# Altium project Science Board 2020.PrjPcb
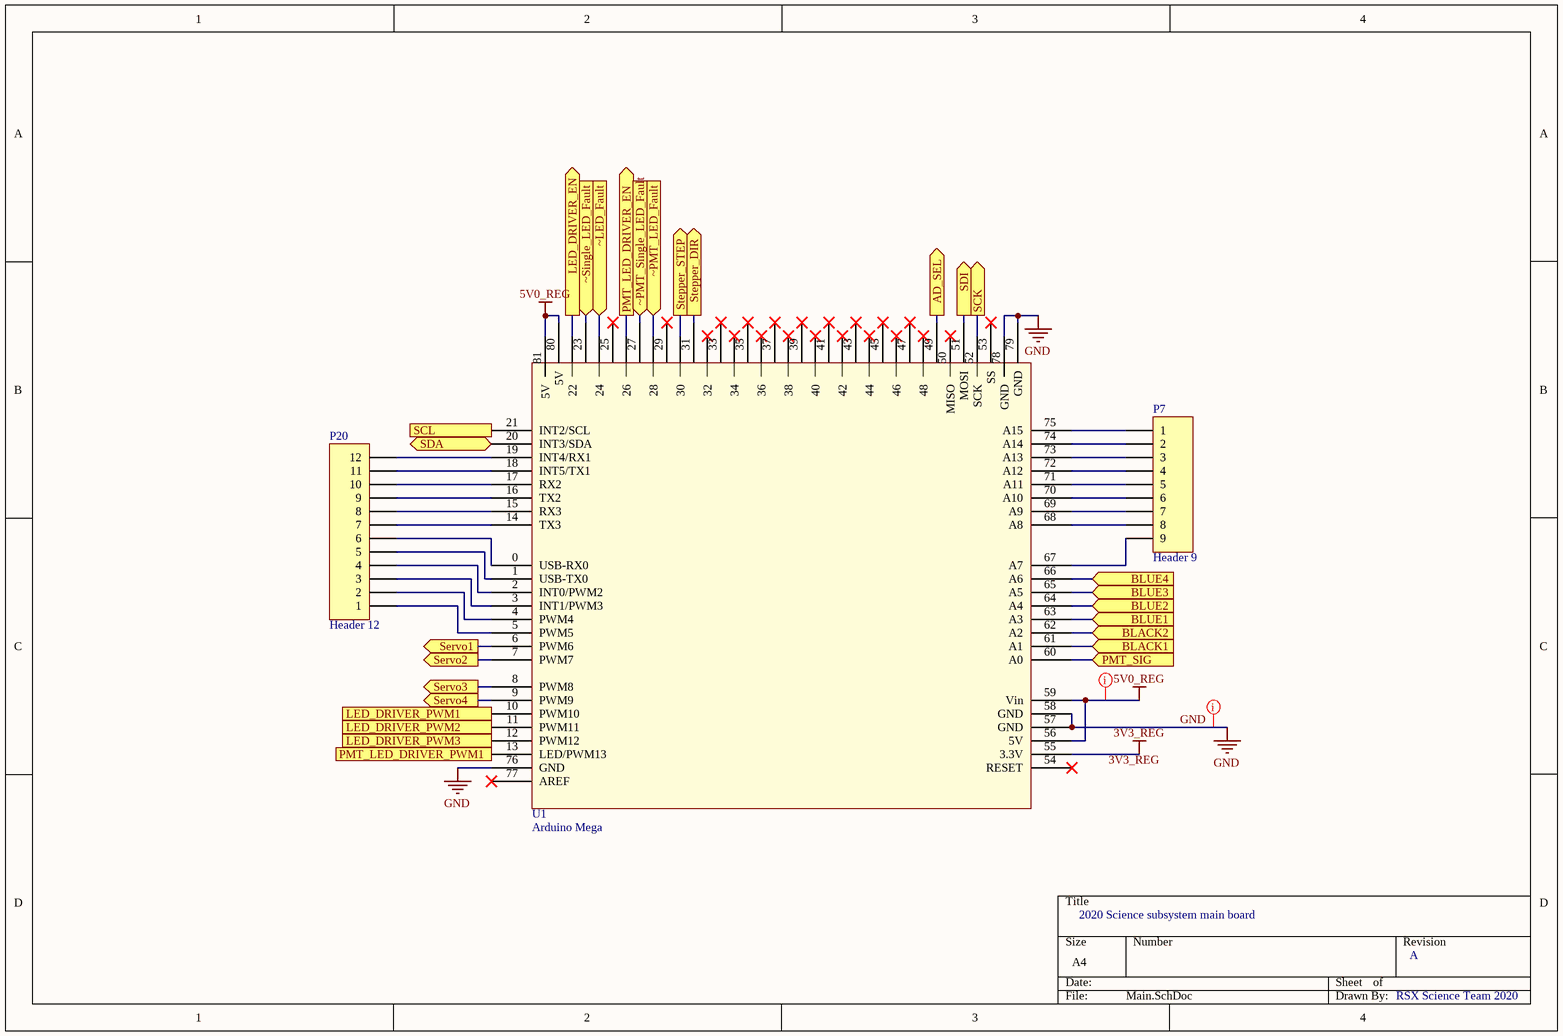
[diagram p0: Main.SchDoc]
4 sheets, 75 parts. Net scope: flat (ports and power ports of the same name join across sheets).
Board file: board.PcbDoc
Sheets:
  Main.SchDoc
  PowerRails.SchDoc
  PowerDevices.SchDoc
  Sensors.SchDoc

## Sheet Main.SchDoc
size A4

### Parts
P7  Header 9  [HDR1X9]
P20  Header 12  [HDR1X12]
U1  Arduino Mega  [Arduino Mega]

### Ports
AD_SEL (out), BLACK1 (in), BLACK2 (in), BLUE1 (in), BLUE2 (in), BLUE3 (in), BLUE4 (in), LED_DRIVER_EN (out), LED_DRIVER_PWM1 (out), LED_DRIVER_PWM2 (out), LED_DRIVER_PWM3 (out), PMT_LED_DRIVER_EN (out), PMT_LED_DRIVER_PWM1 (out), PMT_SIG (in), SCK (out), SCL (out), SDA (bidir), SDI (out), Servo1 (out), Servo2 (out), Servo3 (out), Servo4 (out), Stepper_DIR (out), Stepper_STEP (out), ~LED_Fault (in), ~PMT_LED_Fault (in), ~PMT_Single_LED_Fault (in), ~Single_LED_Fault (in)

### Nets
3V3_REG: U1.55(3.3V)
5V0_REG: U1.56(5V) U1.59(Vin) U1.80(5V) U1.81(5V)
GND: U1.57(GND) U1.58(GND) U1.76(GND) U1.78(GND) U1.79(GND)
NetP2_3: U1.7(PWM7) ; port Servo2
NetP3_3: U1.8(PWM8) ; port Servo3
NetP5_3: U1.9(PWM9) ; port Servo4
NetP6_3: U1.6(PWM6) ; port Servo1
NetP7_1: P7.1 U1.75(A15)
NetP7_2: P7.2 U1.74(A14)
NetP7_3: P7.3 U1.73(A13)
NetP7_4: P7.4 U1.72(A12)
NetP7_5: P7.5 U1.71(A11)
NetP7_6: P7.6 U1.70(A10)
NetP7_7: P7.7 U1.69(A9)
NetP7_8: P7.8 U1.68(A8)
NetP7_9: P7.9 U1.67(A7)
NetP8_1: U1.60(A0) ; port PMT_SIG
NetP9_2: U1.61(A1) ; port BLACK1
NetP10_2: U1.62(A2) ; port BLACK2
NetP11_1: U1.63(A3) ; port BLUE1
NetP12_1: U1.64(A4) ; port BLUE2
NetP13_1: U1.65(A5) ; port BLUE3
NetP14_1: U1.66(A6) ; port BLUE4
NetP16_4: U1.21(INT2/SCL) ; port SCL
NetP16_6: U1.20(INT3/SDA) ; port SDA
NetP20_1: P20.1 U1.5(PWM5)
NetP20_2: P20.2 U1.4(PWM4)
NetP20_3: P20.3 U1.3(INT1/PWM3)
NetP20_4: P20.4 U1.2(INT0/PWM2)
NetP20_5: P20.5 U1.1(USB-TX0)
NetP20_6: P20.6 U1.0(USB-RX0)
NetP20_7: P20.7 U1.14(TX3)
NetP20_8: P20.8 U1.15(RX3)
NetP20_9: P20.9 U1.16(TX2)
NetP20_10: P20.10 U1.17(RX2)
NetP20_11: P20.11 U1.18(INT5/TX1)
NetP20_12: P20.12 U1.19(INT4/RX1)
NetU1_10: U1.10(PWM10) ; port LED_DRIVER_PWM1
NetU1_11: U1.11(PWM11) ; port LED_DRIVER_PWM2
NetU1_12: U1.12(PWM12) ; port LED_DRIVER_PWM3
NetU1_13: U1.13(LED/PWM13) ; port PMT_LED_DRIVER_PWM1
NetU1_22: U1.22 ; port LED_DRIVER_EN
NetU1_23: U1.23 ; port ~Single_LED_Fault
NetU1_24: U1.24 ; port ~LED_Fault
NetU1_26: U1.26 ; port PMT_LED_DRIVER_EN
NetU1_27: U1.27 ; port ~PMT_Single_LED_Fault
NetU1_28: U1.28 ; port ~PMT_LED_Fault
NetU1_30: U1.30 ; port Stepper_STEP
NetU1_31: U1.31 ; port Stepper_DIR
NetU1_49: U1.49 ; port AD_SEL
NetU1_51: U1.51(MOSI) ; port SDI
NetU1_52: U1.52(SCK) ; port SCK

Not connected (* = marked no-connect by the designer): U1 25* 29* 32* 33* 34* 35* 36* 37* 38* 39* 40* 41* 42* 43* 44* 45* 46* 47* 48* 50(MISO)* 53(SS)* 54(RESET)* 77(AREF)*

### Layout directives
rule Width Constraint [Pref Width = 15mil    Min Width = 15mil    Max Width = 15mil]: 5V0_REG, GND

### Notes on the sheet
- 2020 Science subsystem main board
- A
- RSX Science Team 2020
- Labels drawn without touching a wire or pin: 3V3_REG

### Library data of the parts
P7 = Header 9: Header, 9-Pin; LatestRevisionDate: 17-Jul-2002; LatestRevisionNote: Re-released for DXP Platform.; Publisher: Altium Limited
P20 = Header 12: Header, 12-Pin; LatestRevisionDate: 17-Jul-2002; LatestRevisionNote: Re-released for DXP Platform.; Publisher: Altium Limited

## Sheet PowerRails.SchDoc
size A4
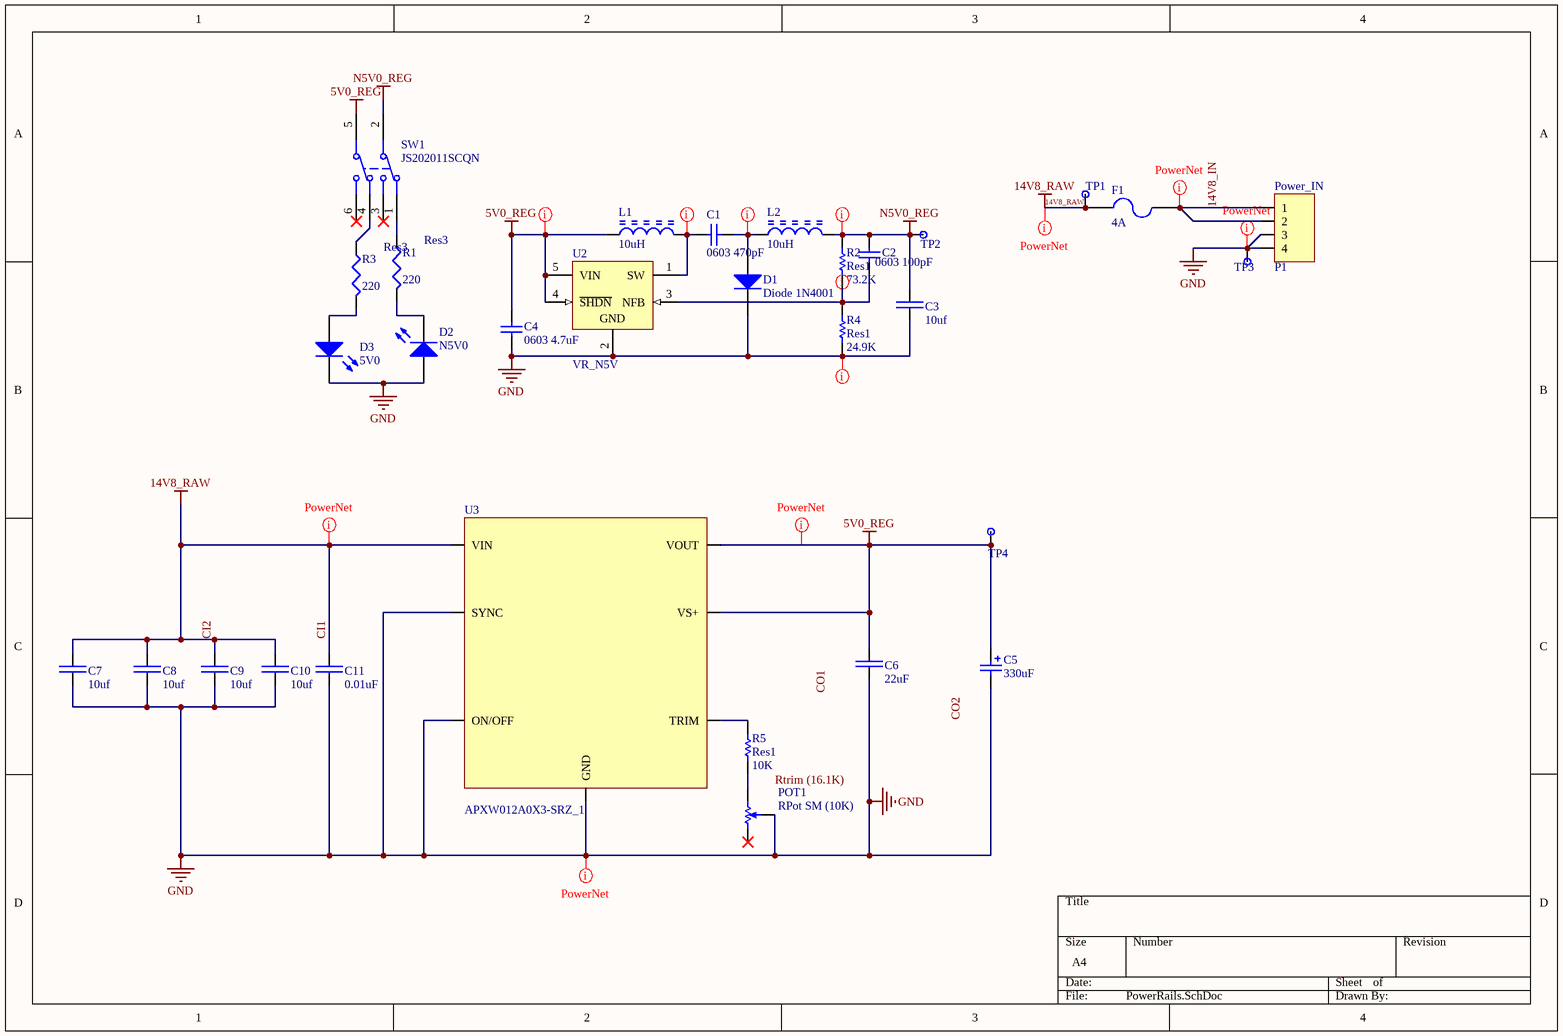
[diagram p1: PowerRails.SchDoc]

### Parts
C1  0603 470pF  [CAPC1608X90X35LL10T15]
C2  0603 100pF  [CAPC1608X90X35LL10T15]
C3  10uf  [10uF capacitor LPB]
C4  0603 4.7uF  [CAPC1608X90X35LL10T15]
C5  330uF  [330uF throught hole]
C6  22uF  [22uF Capacitor]
C7  10uf  [10uF capacitor LPB]
C8  10uf  [10uF capacitor LPB]
C9  10uf  [10uF capacitor LPB]
C10  10uf  [10uF capacitor LPB]
C11  0.01uF  [0.01uF capacitor]
D1  Diode 1N4001  [DO-41]
D2  N5V0  [LTST-C171TBKT]
D3  5V0  [LTST-C171TBKT]
F1  4A  [0157010.DR]
L1  10uH  [BOUR-CM322522_V]
L2  10uH  [BOUR-CM322522_V]
P1  Power_IN  [MOLEX 0039281043]
POT1  RPot SM (10K)  [POT4MM-2]
R1  Res3  value 220  [RESC1608X06N_0603]
R2  Res1  value 73.2K  [RESC1608X06N_0603]
R3  Res3  value 220  [RESC1608X06N_0603]
R4  Res1  value 24.9K  [RESC1608X06N_0603]
R5  Res1  value 10K  [RESC1608X06N_0603]
SW1  JS202011SCQN  [CKCP-JS202011SCQN-6_V]
TP1  5V0_REG  [50_MIL_PAD]  (value not drawn)
TP2  N5V0_REG  [50_MIL_PAD]  (value not drawn)
TP3  12V0_RAW  [50_MIL_PAD]  (value not drawn)
TP4  12V0_RAW  [50_MIL_PAD]  (value not drawn)
U2  VR_N5V  [LT-S5-5-SOT-23_L]
U3  APXW012A0X3-SRZ_1  [APXW012A0X3-SRZ]

### Nets
5V0_REG: C4.2 C5.1 C6.2 L1.1 SW1.5(COM) TP4.1 U2.4(~{SHDN}) U2.5(VIN) U3.3(VS+) U3.5(VOUT)
14V8_RAW: C7.2 C8.2 C9.2 C10.2 C11.2 F1.1 TP1.1 U3.7(VIN)  [also labelled CI1, CI2]
GND: C3.1 C4.1 C5.2 C6.1 C7.1 C8.1 C9.1 C10.1 C11.1 D1.2(K) D2.1(A) D3.2(K) P1.3 P1.4 POT1.W R4.1 TP3.1 U2.2(GND) U3.1(ON/OFF) U3.2(GND) U3.6(SYNC)
N5V0_REG: C2.2 C3.2 L2.2 R2.2 SW1.2(COM) TP2.1
14V8_IN: F1.2 P1.1 P1.2
NetC1_1: C1.1 L1.2 U2.1(SW)
NetC1_2: C1.2 D1.1(A) L2.1
NetC2_1: C2.1 R2.1 R4.2 U2.3(NFB)
NetD2_2: D2.2(K) R1.2
NetD3_1: D3.1(A) R3.2
NetPOT1_CW: POT1.CW(+) R5.1
NetR1_1: R1.1 SW1.1
NetR3_1: R3.1 SW1.4
NetR5_2: R5.2 U3.4(TRIM)

Not connected (* = marked no-connect by the designer): POT1 CCW(-)*; SW1 3* 6*

### Layout directives
net class PowerNet: 5V0_REG, 14V8_IN, 14V8_RAW, GND
rule Width Constraint [Pref Width = 15mil    Min Width = 15mil    Max Width = 15mil]: 5V0_REG, GND, N5V0_REG, NetC1_1, NetC1_2, NetC2_1

### Notes on the sheet
- Labels drawn without touching a wire or pin: CO1, CO2, Rtrim (16.1K)

### Library data of the parts
C1 C2 C4 = CMP-2006-02523-1: Part Number: GRM188R61E475KE11D; Manufacturer: Murata
C3 C7-C10 = GRT31CR61H106ME01L: CAP CER 10UF 50V X5R 1206; Manufacturer 1: Murata; Tolerance: 20%; Supplier 1: Digi-Key; Supplier Part Number 1: 490-12457-1-ND; Manufacturer Part Number 1: GRT31CR61H106ME01L; Stock 1: 8159; Pricing 1: 1=0,50000, 10=0,34900, 100=0,20920, 500=0,15690, 1000=0,13249 (USD); RoHS: Yes; Mount: Surface Mount; Case/Package: 1206; Case Code (Metric): 3216; Case Code (Imperial): 1206; Min Operating Temperature: -55°C; Max Operating Temperature: 85°C; Packaging: Tape and Reel; Capacitance: 10uF; Voltage Rating: 50V; Length: 0.126inch; Width: 0.063inch; Thickness: 0.071inch; Ratings: AEC-Q200; ComponentLink1URL: http://search.murata.co.jp/Ceramy/image/img/A01X/G101/ENG/GRT31CR61H106ME01-01.pdf?src-supplier=Digi-Key; ComponentLink1Description: http://search.murata.co.jp/Ceramy/image/img/A01X/G101/ENG/GRT31CR61H106ME01-01.pdf?src-supplier=Digi-Key; Category: Capacitor
C5 = 35ZLH330MEFCT810X12.5: CAP ALUM 330UF 20% 35V RADIAL; Manufacturer 1: Rubycon; Ripple Current: 731.5mA; Impedance: 39mR; Life (Hours): 10000Hour; Supplier 1: Digi-Key; Supplier Part Number 1: 1189-3752-1-ND; Manufacturer Part Number 1: 35ZLH330MEFCT810X12.5; Stock 1: 14330; Pricing 1: 1=0,52000, 10=0,36900, 100=0,24280 (USD); RoHS: Yes; Mount: Through Hole; Case/Package: Radial; Min Operating Temperature: -40°C; Max Operating Temperature: 105°C; Package Quantity: 1000; Capacitance: 330uF; Packaging: Tape and Reel; Tolerance: 20%; Voltage Rating: 35V; Lead Pitch: 0.197inch; Height - Seated (Max): 0.551inch; ComponentLink1URL: http://www.rubycon.co.jp/en/catalog/e_pdfs/aluminum/e_ZLH.pdf?src-supplier=Digi-Key; ComponentLink1Description: http://www.rubycon.co.jp/en/catalog/e_pdfs/aluminum/e_ZLH.pdf?src-supplier=Digi-Key; ComponentLink2URL: http://www.rubycon.co.jp/en/catalog/e_pdfs/aluminum/Radial_Lead_Alumi_Eng.pdf?src-supplier=Digi-Key; ComponentLink2Description: http://www.rubycon.co.jp/en/catalog/e_pdfs/aluminum/Radial_Lead_Alumi_Eng.pdf?src-supplier=Digi-Key
C6 = GRM32ER71E226KE15L: Cap Ceramic 22uF 25V X7R 10% SMD 1210 125C Embossed T/R; Manufacturer 1: Murata; Supplier 1: Digi-Key; Supplier Part Number 1: 490-5313-6-ND; Manufacturer Part Number 1: GRM32ER71E226KE15L; Stock 1: 52660; Pricing 1: 1=1,78000, 10=1,40600, 100=1,05410, 500=0,79646 (USD); RoHS: Yes; Mount: Surface Mount; Case/Package: 1210; Number of Pins: 2; Case Code (Metric): 3225; Case Code (Imperial): 1210; Material: Ceramic; Min Operating Temperature: -55°C; Max Operating Temperature: 125°C; Capacitance: 22uF; Tolerance: 10%; Dielectric: X7R; Voltage Rating: 25V; Packaging: Tape and Reel; Package Quantity: 1; Voltage Rating (DC): 25V; Termination: SMD/SMT; Voltage: 25V; Length: 3.2mm; Height: 2.5mm; Width: 0.098inch; Thickness: 0.106inch; Depth: 2.5mm; Radiation Hardening: No; REACH SVHC: No SVHC; Lead Free: Lead Free; ComponentLink1URL: https://datasheet.ciiva.com/6072/1697714-6072768.pdf?src-supplier=Farnell; ComponentLink1Description: https://datasheet.ciiva.com/6072/1697714-6072768.pdf?src-supplier=Farnell; ComponentLink2URL: https://datasheet.ciiva.com/16497/product-16497009.pdf?src-supplier=Future+Electronics; ComponentLink2Description: https://datasheet.ciiva.com/16497/product-16497009.pdf?src-supplier=Future+Electronics; ComponentLink3URL: https://datasheet.ciiva.com/3776/2741grm32er71e226ke1523-3776996.pdf?src-supplier=Arrow; ComponentLink3Description: https://datasheet.ciiva.com/3776/2741grm32er71e226ke1523-3776996.pdf?src-supplier=Arrow; ComponentLink4URL: https://datasheet.ciiva.com/11789/0900766b80ef921d-11789129.pdf?src-supplier=RSComponents; ComponentLink4Description: https://datasheet.ciiva.com/11789/0900766b80ef921d-11789129.pdf?src-supplier=RSComponents; ComponentLink5URL: https://datasheet.ciiva.com/29201/451826-da-01-de-vs-kondens-grm32-er71e-226ke15l-29201795.pdf?src-supplier=Conrad; ComponentLink5Description: https://datasheet.ciiva.com/29201/451826-da-01-de-vs-kondens-grm32-er71e-226ke15l-29201795.pdf?src-supplier=Conrad; ComponentLink6URL: https://datasheet.ciiva.com/175/partnumbering-e-01-175746.pdf?src-supplier=Digi-Key; ComponentLink6Description: https://datasheet.ciiva.com/175/partnumbering-e-01-175746.pdf?src-supplier=Digi-Key; ComponentLink7URL: https://datasheet.ciiva.com/175/partnumbering-e-01-175747.pdf?src-supplier=Digi-Key; ComponentLink7Description: https://datasheet.ciiva.com/175/partnumbering-e-01-175747.pdf?src-supplier=Digi-Key; ComponentLink8URL: https://datasheet.ciiva.com/175/partnumbering-e-01-175748.pdf?src-supplier=Digi-Key; ComponentLink8Description: https://datasheet.ciiva.com/175/partnumbering-e-01-175748.pdf?src-supplier=Digi-Key; ComponentLink9URL: https://datasheet.ciiva.com/22703/1697714-22703397.pdf?src-supplier=Element14; ComponentLink9Description: https://datasheet.ciiva.com/22703/1697714-22703397.pdf?src-supplier=Element14; Category: Capacitor
C11 = C0603C103KARACAUTO: Cap Ceramic 0.01uF 250V X7R 10% Pad SMD 0603 125C Automotive T/R; Manufacturer 1: KEMET; Capacitance: 10nF; Supplier 1: Digi-Key; Supplier Part Number 1: 399-17960-1-ND; Manufacturer Part Number 1: C0603C103KARACAUTO; Stock 1: 8483; Pricing 1: 1=0,90000, 10=0,68500, 100=0,49040, 500=0,37964, 1000=0,32691 (USD); RoHS: No; Mount: Surface Mount; Case/Package: 0603; Case Code (Imperial): 0603; Case Code (Metric): 1608; Min Operating Temperature: -55°C; Max Operating Temperature: 125°C; Packaging: Tape and Reel; Tolerance: 10%; Voltage Rating: 250V; Ratings: AEC-Q200; ComponentLink1URL: https://api.kemet.com/component-edge/download/datasheet/C0603C103KARACAUTO.pdf?src-supplier=Digi-Key; ComponentLink1Description: https://api.kemet.com/component-edge/download/datasheet/C0603C103KARACAUTO.pdf?src-supplier=Digi-Key; Category: Capacitor
D1 = Diode 1N4001: 1 Amp General Purpose Rectifier; Published: 8-Jun-2000; LatestRevisionDate: 17-Jul-2002; LatestRevisionNote: Re-released for DXP Platform.; DatasheetVersion: 1998; PackageVersion: Aug-1999; PackageReference: DO-41; Publisher: Altium Limited; PackageDescription: Diode, Axial; Body 5.2 x 2.7 mm (LxDia. max), Lead Dia. 0.86 mm (max); Code_JEDEC: DO-204-AL; ComponentLink1Description: Manufacturer Link; ComponentLink1URL: http://www.fairchildsemi.com/; ComponentLink2Description: Datasheet; ComponentLink2URL: http://www.fairchildsemi.com/ds/1N%2F1N4001.pdf
D2 D3 = Blue LED
F1 = Fuse 2: Fuse; Published: 8-Jun-2000; LatestRevisionDate: 17-Jul-2002; LatestRevisionNote: Re-released for DXP Platform.; PackageReference: PIN-W2/E2.8; Publisher: Altium Limited; PackageDescription: Thru-Hole; 2 Leads
L1 L2 = CMP-1747-00008-1: Chip Inductor / , 10 uH, +/- 10%, -40 to 125 degC, 1210 (3225 Metric), RoHS, Tape and Reel; Current Rating: 1.5 A; Colour: White; Gender: Female; Connector Type: USB; Min Operating Temperature: -55 degC; ComponentLink2Description: Datasheet; Packaging: Tray; Contact Material: Bronze; ComponentLink1Description: Manufacturer URL; PackageDescription: 2-Pin Surface Mount Device, Body 3.2 x 2.5 mm; Contact Plating: Gold; Max Operating Temperature: 85 degC; ComponentLink2URL: http://www.bourns.com/docs/Product-Datasheets/cm322522.pdf; PackageReference: 1210; Radiation Hardening: No; DatasheetVersion: Aug-14; Package Quantity: 100; Pins: 4; Mount: Through Hole; Lead Pitch: 2.5 mm; ComponentLink1URL: http://www.bourns.com/; Height: 15.9 mm; RoHSCompliant: true; Width: 11.15 mm
P1 = Molex 0039281043: Mini-Fit Jr. Header, Dual Row, Right-Angle, with Snap-in Plastic Peg PCB Lock, 6 Circuits, PA Polyamide Nylon 6/6 94V-2, 0.76µm Select Gold (Au) Plating
POT1 = RPot SM: Square Trimming Potentiometer; Published: 17-Dec-2003; DatasheetVersion: Oct-2003; PackageReference: POT4MM-2; Publisher: Altium Limited; PackageDescription: Square Trimming Potentiometer; ComponentLink1Description: Manufacturer Link; ComponentLink1URL: http://bourns.com/2/search.html
R1 R3 = Res3: Resistor; Published: 8-Jun-2000; LatestRevisionDate: 29-May-2009; LatestRevisionNote: IPC-7351 Footprint Added.; PackageReference: J1-0603; Publisher: Altium Limited; PackageDescription: Chip Resistor
R2 R4 R5 = Res1: Resistor; Published: 8-Jun-2000; LatestRevisionDate: 17-Jul-2002; LatestRevisionNote: Re-released for DXP Platform.; PackageReference: AXIAL-0.3; Publisher: Altium Limited; PackageDescription: Axial Device, Thru-Hole; 2 Leads; 0.3 in Pin Spacing
SW1 = CMP-2000-05087-1: Switch Slide DPDT, 0.3 A, 6 V, -40 to 85 degC, 6-Pin SMD, RoHS, Tape and Reel; Manufacturer: C&K Components; Contact Rating @ Voltage: 0.3@6VDCA; COO: US; Maximum DC Voltage Rating: 6V; Minimum Insulation Resistance: 100MOhm; Actuator Color: Black; Body Orientation: Straight; Actuator Material: Nylon4/6; Dielectric Strength: 500VAC; Maximum Contact Resistance: 70mOhm; Actuator Style: TopSlide; Electrical Life: 15000Cycles; Seal Location: N/A; Base Material: N/A; Mechanical Life: N/A; Switch Configuration: N/A; HTS: 8536509050; Contact Material: CopperAlloy; Supplier Standard Pack: 5,000; Manufacturer URL: http://www.ckswitches.com; Supplier: C&KComponents; Datasheet URL: http://datasheet.octopart.com/JS202011SCQN-C%26K-Components-datasheet-62100994.pdf; Housing Material: Nylon4/6; Product Weight: N/A; Dimension: 9x7.5x5.5mm; Maximum AC Voltage Rating: N/A; ECCN: EAR99; Contact Plating: Silver; Pole Throw Configuration: DPDT; Packaging: TapeandReel; Part No: JS202011SCQN; Datasheet Version: Sep-15; Seal Description: N/A; RoHS: Yes; Mounting: SurfaceMount,GullWing; Family: JS; Type: Sub-Miniature; Operating Temperature: -40to85C
TP1-TP4 = TestPt
U2 = CMP-0491-01503-1: Micropower Inverting DC/DC Converter, 5-pin SOT23 (S5-5), -40 to 85 degC, Pb-Free, Mini Tape and Reel; PartNumber: LT1617ES5#TRMPBF; Manufacturer: Linear Technology; Number of Outputs: 1; RoHS: TRUE; ComponentLink3URL: http://cds.linear.com/docs/en/datasheet/17278fb.pdf; ComponentLink2Description: Datasheet; Packing: Mini Tape and Reel; PackageReference: S5-5; ComponentLink1URL: http://www.linear.com/; Mounting Technology: Surface Mount; PackageDescription: 5-Pin Plastic SOT-23, Body 1.625 x 2.90 mm, Pitch 0.95 mm; ComponentLink3Description: Package Specification; ComponentLink2URL: http://cds.linear.com/docs/en/datasheet/16171f.pdf; PackageVersion: Aug-07; ComponentLink1Description: Manufacturer URL
U3 = APXW012A0X3-SRZ_1: DC DC CONVERTER 3-18V 12A; Manufacturer 1: GE; Number of Outputs: 1; Min Input Voltage: 9V; Max Input Voltage: 36V; Voltage - Output 1: 18V; Efficiency: 95.5%; Supplier 1: Avnet; Supplier Part Number 1: 150028492; Manufacturer Part Number 1: APXW012A0X3-SRZ; Stock 1: 0; RoHS: Yes; Mount: Surface Mount; Case/Package: Module; Number of Pins: 9; Min Operating Temperature: -40°C; Max Operating Temperature: 85°C; Packaging: Tape and Reel; Max Output Current: 12A; Current - Output 1: 12A; Package Quantity: 140; Output Current: 12A; Output Voltage: 18V; Features: OCP,OTP; Length: 1.3inch; Height: 0.39inch; Width: 0.53inch; ComponentLink1URL: http://apps.geindustrial.com/publibrary/checkout/DS-APXW012?TNR=Data%20Sheets&src-supplier=Avnet; ComponentLink1Description: http://apps.geindustrial.com/publibrary/checkout/DS-APXW012?TNR=Data%20Sheets&src-supplier=Avnet; ComponentLink2URL: http://apps.geindustrial.com/publibrary/checkout/DS-APXW012?TNR=Data%20Sheets|DS-APXW012|generic&src-supplier=Digi-Key; ComponentLink2Description: http://apps.geindustrial.com/publibrary/checkout/DS-APXW012?TNR=Data%20Sheets|DS-APXW012|generic&src-supplier=Digi-Key; ComponentLink3URL: http://apps.geindustrial.com/publibrary/checkout/DS-APXW012?TNR=Data%20Sheets%7CDS-APXW012%7Cgeneric&src-supplier=Mouser; ComponentLink3Description: http://apps.geindustrial.com/publibrary/checkout/DS-APXW012?TNR=Data%20Sheets%7CDS-APXW012%7Cgeneric&src-supplier=Mouser; Category: Buck Converter

## Sheet PowerDevices.SchDoc
size A4
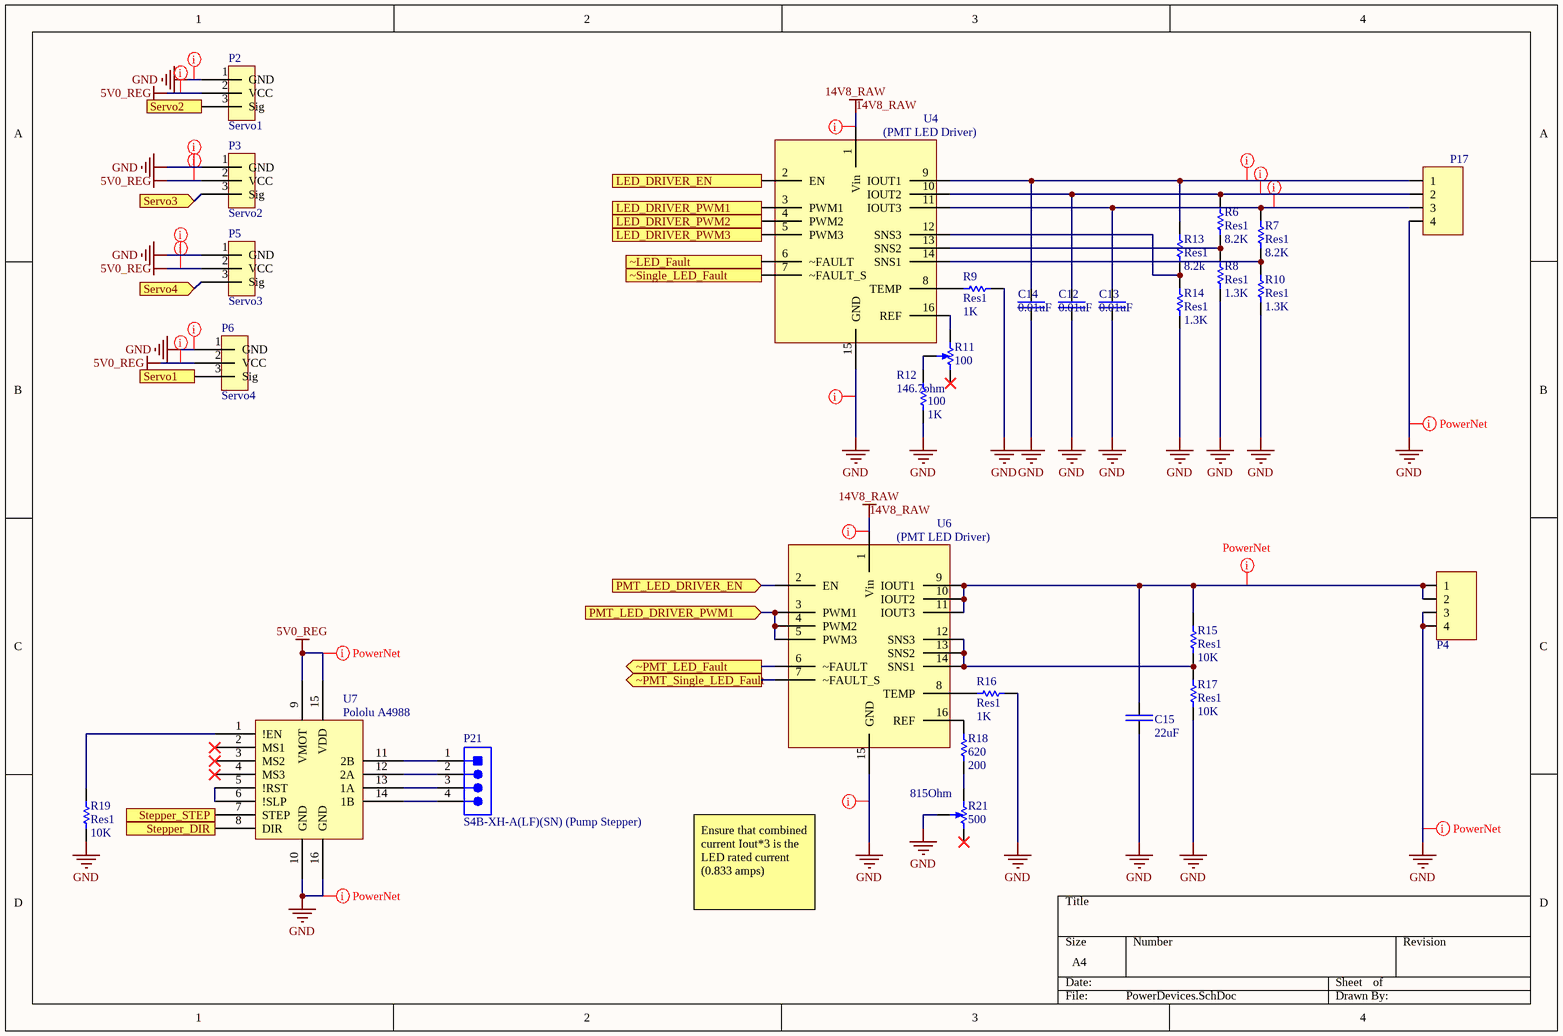
[diagram p2: PowerDevices.SchDoc]

### Parts
C12  0.01uF  [0.01uF capacitor]
C13  0.01uF  [0.01uF capacitor]
C14  0.01uF  [0.01uF capacitor]
C15  22uF  [22uF Capacitor]
P2  Servo1  [Header3]
P3  Servo2  [Header3]
P4  Mini-Fit Jr 4 Pos  [MOLEX 0039281043]  (value not drawn)
P5  Servo3  [Header3]
P6  Servo4  [Header3]
P17  Mini-Fit Jr 4 Pos  [MOLEX 0039281043]  (value not drawn)
P21  S4B-XH-A(LF)(SN) (Pump Stepper)  [JST-S4B-XH-A(LF)(SN)_V]
R6  Res1  value 8.2K  [RESC1608X06N_0603]
R7  Res1  value 8.2K  [RESC1608X06N_0603]
R8  Res1  value 1.3K  [RESC1608X06N_0603]
R9  Res1  value 1K  [RESC1608X06N_0603]
R10  Res1  value 1.3K  [RESC1608X06N_0603]
R11  100  [POT-LV10]
R12  100  value 1K  [RESC1608X06N_0603]
R13  Res1  value 8.2k  [RESC1608X06N_0603]
R14  Res1  value 1.3K  [RESC1608X06N_0603]
R15  Res1  value 10K  [RESC1608X06N_0603]
R16  Res1  value 1K  [RESC1608X06N_0603]
R17  Res1  value 10K  [RESC1608X06N_0603]
R18  620  value 200  [RESC1608X06N_0603]
R19  Res1  value 10K  [RESC1608X06N_0603]
R21  500  [POT-LV10]
U4  (PMT LED Driver)  [HTSSOP16]
U6  (PMT LED Driver)  [HTSSOP16]
U7  Pololu A4988  [Stepper Driver Pololu A4988]

### Ports
LED_DRIVER_EN (in), LED_DRIVER_PWM1 (in), LED_DRIVER_PWM2 (in), LED_DRIVER_PWM3 (in), PMT_LED_DRIVER_EN (in), PMT_LED_DRIVER_PWM1 (in), Servo1 (in), Servo2 (in), Servo3 (in), Servo4 (in), Stepper_DIR (in), Stepper_STEP (in), ~LED_Fault (out), ~PMT_LED_Fault (out), ~PMT_Single_LED_Fault (out), ~Single_LED_Fault (out)

### Nets
5V0_REG: P2.2(VCC) P3.2(VCC) P5.2(VCC) P6.2(VCC) U7.9(VMOT) U7.15(VDD)
14V8_RAW: U4.1(Vin) U6.1(Vin)
GND: C12.1 C13.1 C14.1 C15.1 P2.1(GND) P3.1(GND) P4.3 P4.4 P5.1(GND) P6.1(GND) P17.4 R8.1 R9.2 R10.1 R12.2 R14.1 R16.2 R17.1 R19.1 R21.W U4.15(GND) U6.15(GND) U7.10(GND) U7.16(GND)
NetC12_2: C12.2 P17.2 R6.2 U4.10(IOUT2)
NetC13_2: C13.2 P17.3 R7.2 U4.11(IOUT3)
NetC14_2: C14.2 P17.1 R13.1 U4.9(IOUT1)
NetC15_2: C15.2 P4.1 P4.2 R15.1 U6.9(IOUT1) U6.10(IOUT2) U6.11(IOUT3)
NetP2_3: P2.3(Sig) ; port Servo2
NetP3_3: P3.3(Sig) ; port Servo3
NetP5_3: P5.3(Sig) ; port Servo4
NetP6_3: P6.3(Sig) ; port Servo1
NetP21_1: P21.1 U7.11(2B)
NetP21_2: P21.2 U7.12(2A)
NetP21_3: P21.3 U7.13(1A)
NetP21_4: P21.4 U7.14(1B)
NetR6_1: R6.1 R8.2 U4.13(SNS2)
NetR7_1: R7.1 R10.2 U4.14(SNS1)
NetR9_1: R9.1 U4.8(TEMP)
NetR11_CCW: R11.CCW(-) U4.16(REF)
NetR11_W: R11.W R12.1
NetR13_2: R13.2 R14.2 U4.12(SNS3)
NetR15_2: R15.2 R17.2 U6.12(SNS3) U6.13(SNS2) U6.14(SNS1)
NetR16_1: R16.1 U6.8(TEMP)
NetR18_1: R18.1 R21.CCW(-)
NetR18_2: R18.2 U6.16(REF)
NetR19_2: R19.2 U7.1(!EN)
NetU1_10: U4.3(PWM1) ; port LED_DRIVER_PWM1
NetU1_11: U4.4(PWM2) ; port LED_DRIVER_PWM2
NetU1_12: U4.5(PWM3) ; port LED_DRIVER_PWM3
NetU1_13: U6.3(PWM1) U6.4(PWM2) U6.5(PWM3) ; port PMT_LED_DRIVER_PWM1
NetU1_22: U4.2(EN) ; port LED_DRIVER_EN
NetU1_23: U4.7(~FAULT_S) ; port ~Single_LED_Fault
NetU1_24: U4.6(~FAULT) ; port ~LED_Fault
NetU1_26: U6.2(EN) ; port PMT_LED_DRIVER_EN
NetU1_27: U6.7(~FAULT_S) ; port ~PMT_Single_LED_Fault
NetU1_28: U6.6(~FAULT) ; port ~PMT_LED_Fault
NetU1_30: U7.7(STEP) ; port Stepper_STEP
NetU1_31: U7.8(DIR) ; port Stepper_DIR
NetU7_5: U7.5(!RST) U7.6(!SLP)

Not connected (* = marked no-connect by the designer): R11 CW(+)*; R21 CW(+)*; U7 2(MS1)* 3(MS2)* 4(MS3)*

### Layout directives
rule Width Constraint [Pref Width = 15mil    Min Width = 15mil    Max Width = 15mil]: 5V0_REG, 14V8_RAW, GND, NetC12_2, NetC13_2, NetC14_2
net class PowerNet: GND, NetC15_2
mark named PowerNet: 5V0_REG, GND

### Notes on the sheet
- (near R12) 146.7ohm
- (near R21) 815Ohm
- Ensure that combined current Iout*3 is the LED rated current (0.833 amps)

### Library data of the parts
C12-C14 = C0603C103KARACAUTO: as C11 on sheet PowerRails; Supplier 1: Digi-Key; Supplier Part Number 1: 399-17960-1-ND; Manufacturer Part Number 1: C0603C103KARACAUTO; Stock 1: 8483; Pricing 1: 1=0,90000, 10=0,68500, 100=0,49040, 500=0,37964, 1000=0,32691 (USD); RoHS: No; Mount: Surface Mount; Case/Package: 0603; Case Code (Imperial): 0603; Case Code (Metric): 1608; Min Operating Temperature: -55°C; Max Operating Temperature: 125°C; Packaging: Tape and Reel; Tolerance: 10%; Voltage Rating: 250V; Ratings: AEC-Q200; ComponentLink1URL: https://api.kemet.com/component-edge/download/datasheet/C0603C103KARACAUTO.pdf?src-supplier=Digi-Key; ComponentLink1Description: https://api.kemet.com/component-edge/download/datasheet/C0603C103KARACAUTO.pdf?src-supplier=Digi-Key; Category: Capacitor
C15 = GRM32ER71E226KE15L: as C6 on sheet PowerRails; Supplier 1: Digi-Key; Supplier Part Number 1: 490-5313-6-ND; Manufacturer Part Number 1: GRM32ER71E226KE15L; Stock 1: 52660; Pricing 1: 1=1,78000, 10=1,40600, 100=1,05410, 500=0,79646 (USD); RoHS: Yes; Mount: Surface Mount; Case/Package: 1210; Number of Pins: 2; Case Code (Metric): 3225; Case Code (Imperial): 1210; Material: Ceramic; Min Operating Temperature: -55°C; Max Operating Temperature: 125°C; Capacitance: 22uF; Tolerance: 10%; Dielectric: X7R; Voltage Rating: 25V; Packaging: Tape and Reel; Package Quantity: 1; Voltage Rating (DC): 25V; Termination: SMD/SMT; Voltage: 25V; Length: 3.2mm; Height: 2.5mm; Width: 0.098inch; Thickness: 0.106inch; Depth: 2.5mm; Radiation Hardening: No; REACH SVHC: No SVHC; Lead Free: Lead Free; ComponentLink1URL: https://datasheet.ciiva.com/6072/1697714-6072768.pdf?src-supplier=Farnell; ComponentLink1Description: https://datasheet.ciiva.com/6072/1697714-6072768.pdf?src-supplier=Farnell; ComponentLink2URL: https://datasheet.ciiva.com/16497/product-16497009.pdf?src-supplier=Future+Electronics; ComponentLink2Description: https://datasheet.ciiva.com/16497/product-16497009.pdf?src-supplier=Future+Electronics; ComponentLink3URL: https://datasheet.ciiva.com/3776/2741grm32er71e226ke1523-3776996.pdf?src-supplier=Arrow; ComponentLink3Description: https://datasheet.ciiva.com/3776/2741grm32er71e226ke1523-3776996.pdf?src-supplier=Arrow; ComponentLink4URL: https://datasheet.ciiva.com/11789/0900766b80ef921d-11789129.pdf?src-supplier=RSComponents; ComponentLink4Description: https://datasheet.ciiva.com/11789/0900766b80ef921d-11789129.pdf?src-supplier=RSComponents; ComponentLink5URL: https://datasheet.ciiva.com/29201/451826-da-01-de-vs-kondens-grm32-er71e-226ke15l-29201795.pdf?src-supplier=Conrad; ComponentLink5Description: https://datasheet.ciiva.com/29201/451826-da-01-de-vs-kondens-grm32-er71e-226ke15l-29201795.pdf?src-supplier=Conrad; ComponentLink6URL: https://datasheet.ciiva.com/175/partnumbering-e-01-175746.pdf?src-supplier=Digi-Key; ComponentLink6Description: https://datasheet.ciiva.com/175/partnumbering-e-01-175746.pdf?src-supplier=Digi-Key; ComponentLink7URL: https://datasheet.ciiva.com/175/partnumbering-e-01-175747.pdf?src-supplier=Digi-Key; ComponentLink7Description: https://datasheet.ciiva.com/175/partnumbering-e-01-175747.pdf?src-supplier=Digi-Key; ComponentLink8URL: https://datasheet.ciiva.com/175/partnumbering-e-01-175748.pdf?src-supplier=Digi-Key; ComponentLink8Description: https://datasheet.ciiva.com/175/partnumbering-e-01-175748.pdf?src-supplier=Digi-Key; ComponentLink9URL: https://datasheet.ciiva.com/22703/1697714-22703397.pdf?src-supplier=Element14; ComponentLink9Description: https://datasheet.ciiva.com/22703/1697714-22703397.pdf?src-supplier=Element14; Category: Capacitor
P2 P3 P5 P6 = Header3
P4 P17 = Molex 0039281043: as P1 on sheet PowerRails
P21 = CMP-1755-00007-1: Male Header, Pitch 2.5 mm, 1 x 4 Position, Height 6.1 mm, Tail Length 3.4 mm, -25 to 85 degC, RoHS, Bulk; PackageReference: S4B-XH-A(LF)(SN); ComponentLink1Description: Manufacturer URL; DatasheetVersion: May-16; ComponentLink2Description: Datasheet; ComponentLink2URL: http://www.jst-mfg.com/product/pdf/eng/eXH.pdf; ComponentLink1URL: http://www.jst.com/home2.html; PackageDescription: Male Header, Pitch 2.5 mm, 1 x 4 Position, Height 6.1 mm, Tail Length 3.4 mm
R6-R10 R12-R19 = Res1: Resistor; Published: 8-Jun-2000; LatestRevisionDate: 17-Jul-2002; LatestRevisionNote: Re-released for DXP Platform.; PackageReference: AXIAL-0.3; Publisher: Altium Limited; PackageDescription: Axial Device, Thru-Hole; 2 Leads; 0.3 in Pin Spacing
R11 R21 = RPot SM: Square Trimming Potentiometer (100 ohm); Published: 17-Dec-2003; DatasheetVersion: Oct-2003; PackageReference: POT4MM-2; Publisher: Altium Limited; PackageDescription: Square Trimming Potentiometer; ComponentLink1Description: Manufacturer Link; ComponentLink1URL: http://bourns.com/2/search.html
U4 U6 = TPS92630QPWPRQ1
U7 = stepper driver Pololu a4988

## Sheet Sensors.SchDoc
size A4
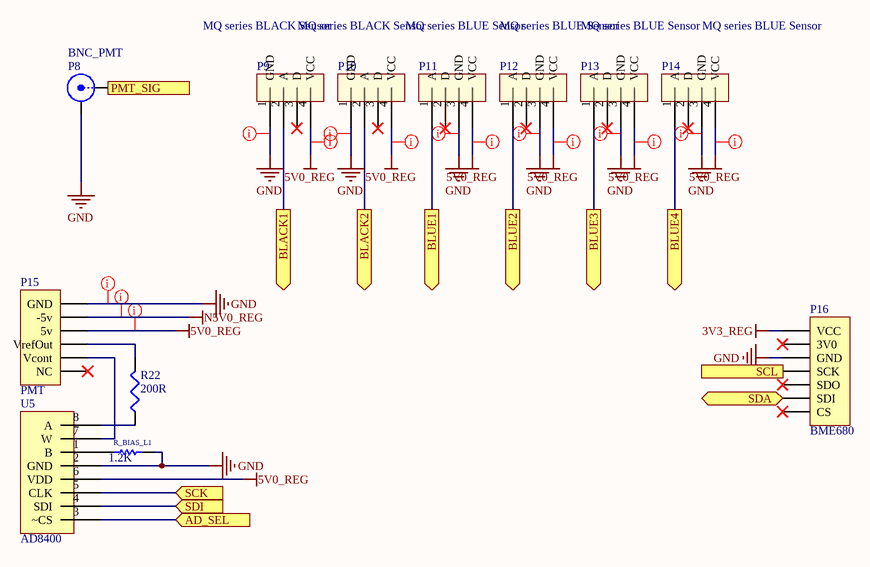
[diagram p3: Sensors.SchDoc]

### Parts
P8  BNC_PMT  [BNC_RA CON]
P9  MQ series BLACK Sensor  [MQ series BLACK sensor]
P10  MQ series BLACK Sensor  [MQ series BLACK sensor]
P11  MQ series BLUE Sensor  [MQ series BLUE sensor]
P12  MQ series BLUE Sensor  [MQ series BLUE sensor]
P13  MQ series BLUE Sensor  [MQ series BLUE sensor]
P14  MQ series BLUE Sensor  [MQ series BLUE sensor]
P15  PMT  [HDR1X6H]
P16  BME680  [HDR1X7]
R22  200R  [RESC1608X06N_0603]
R_BIAS_L1  1.2K  [RESC1608X06N_0603]
U5  AD8400  [AD8400(SOIC8)]

### Ports
AD_SEL (in), BLACK1 (out), BLACK2 (out), BLUE1 (out), BLUE2 (out), BLUE3 (out), BLUE4 (out), PMT_SIG (out), SCK (in), SCL (in), SDA (bidir), SDI (in)

### Nets
3V3_REG: P16.1(VCC)
5V0_REG: P9.4(VCC) P10.4(VCC) P11.4(VCC) P12.4(VCC) P13.4(VCC) P14.4(VCC) P15.6(5v) U5.6(VDD)
GND: P8.2(Y) P9.1(GND) P10.1(GND) P11.3(GND) P12.3(GND) P13.3(GND) P14.3(GND) P15.4(GND) P16.3(GND) R_BIAS_L1.2 U5.2(GND)
N5V0_REG: P15.5(-5v)
NetP8_1: P8.1(X) ; port PMT_SIG
NetP9_2: P9.2(A) ; port BLACK1
NetP10_2: P10.2(A) ; port BLACK2
NetP11_1: P11.1(A) ; port BLUE1
NetP12_1: P12.1(A) ; port BLUE2
NetP13_1: P13.1(A) ; port BLUE3
NetP14_1: P14.1(A) ; port BLUE4
NetP15_2: P15.2(Vcont) U5.7(W)
NetP15_3: P15.3(VrefOut) R22.2
NetP16_4: P16.4(SCK) ; port SCL
NetP16_6: P16.6(SDI) ; port SDA
NetR22_1: R22.1 U5.8(A)
NetR_BIAS_L1_1: R_BIAS_L1.1 U5.1(B)
NetU1_49: U5.3(~CS) ; port AD_SEL
NetU1_51: U5.4(SDI) ; port SDI
NetU1_52: U5.5(CLK) ; port SCK

Not connected (* = marked no-connect by the designer): P9 3(D)*; P10 3(D)*; P11 2(D)*; P12 2(D)*; P13 2(D)*; P14 2(D)*; P15 1(NC)*; P16 2(3V0)* 5(SDO)* 7(CS)*

### Layout directives
rule Width Constraint [Pref Width = 15mil    Min Width = 15mil    Max Width = 15mil]: 5V0_REG, GND, N5V0_REG

### Library data of the parts
P8 = BNC: BNC Elbow Connector; LatestRevisionDate: 17-Jul-2002; LatestRevisionNote: Re-released for DXP Platform.; Publisher: Altium Limited
P15 = Header 6H: Header, 6-Pin, Right Angle; LatestRevisionDate: 17-Jul-2002; LatestRevisionNote: Re-released for DXP Platform.; Publisher: Altium Limited
P16 = Header 7: Header, 7-Pin; LatestRevisionDate: 17-Jul-2002; LatestRevisionNote: Re-released for DXP Platform.; Publisher: Altium Limited
R22 = RC1206FR-07200RL: RES SMD 200 OHM 1% 1/4W 1206; Manufacturer 1: Yageo; Temperature Coefficient: 100ppm/°C; Voltage Rating (DC): 200V; Power Rating: 250mW; Supplier 1: Digi-Key; Supplier Part Number 1: 311-200FRCT-ND; Manufacturer Part Number 1: RC1206FR-07200RL; Stock 1: 3032350; Pricing 1: 1=0,10000, 10=0,07100, 100=0,02910, 1000=0,01306, 2500=0,01134 (USD); RoHS: Yes; Mount: Surface Mount; Case/Package: 1206; Weight: 0.000571oz; Case Code (Imperial): 1206; Case Code (Metric): 3216; Min Operating Temperature: -55°C; Max Operating Temperature: 155°C; Tolerance: 1%; Resistance: 200R; Packaging: Tape and Reel; Composition: Thick Film; Voltage Rating: 200V; Termination: SMD/SMT; Military Standard: Not; Length: 3.1mm; Height: 0.55mm; Width: 1.6mm; Depth: 1.6mm; Lead Free: Lead Free; ComponentLink1URL: https://datasheet.ciiva.com/11808/0900766b80c6630a-11808603.pdf?src-supplier=RSComponents; ComponentLink1Description: https://datasheet.ciiva.com/11808/0900766b80c6630a-11808603.pdf?src-supplier=RSComponents; Category: Resistor
R_BIAS_L1 = Res1: Resistor; Published: 8-Jun-2000; LatestRevisionDate: 17-Jul-2002; LatestRevisionNote: Re-released for DXP Platform.; PackageReference: AXIAL-0.3; Publisher: Altium Limited; PackageDescription: Axial Device, Thru-Hole; 2 Leads; 0.3 in Pin Spacing
U5 = Component_1

## Nets that join several sheets
3V3_REG: Main (U1.55), Sensors (P16.1)
5V0_REG: Main (U1.56 U1.59 U1.80 U1.81), PowerRails (10 pins), PowerDevices (6 pins), Sensors (8 pins)
14V8_RAW: PowerRails (8 pins), PowerDevices (U4.1 U6.1)
GND: Main (5 pins), PowerRails (21 pins), PowerDevices (24 pins), Sensors (11 pins)
N5V0_REG: PowerRails (6 pins), Sensors (P15.5)
NetP2_3: Main (U1.7), PowerDevices (P2.3)
NetP3_3: Main (U1.8), PowerDevices (P3.3)
NetP5_3: Main (U1.9), PowerDevices (P5.3)
NetP6_3: Main (U1.6), PowerDevices (P6.3)
NetP8_1: Main (U1.60), Sensors (P8.1)
NetP9_2: Main (U1.61), Sensors (P9.2)
NetP10_2: Main (U1.62), Sensors (P10.2)
NetP11_1: Main (U1.63), Sensors (P11.1)
NetP12_1: Main (U1.64), Sensors (P12.1)
NetP13_1: Main (U1.65), Sensors (P13.1)
NetP14_1: Main (U1.66), Sensors (P14.1)
NetP16_4: Main (U1.21), Sensors (P16.4)
NetP16_6: Main (U1.20), Sensors (P16.6)
NetU1_10: Main (U1.10), PowerDevices (U4.3)
NetU1_11: Main (U1.11), PowerDevices (U4.4)
NetU1_12: Main (U1.12), PowerDevices (U4.5)
NetU1_13: Main (U1.13), PowerDevices (U6.3 U6.4 U6.5)
NetU1_22: Main (U1.22), PowerDevices (U4.2)
NetU1_23: Main (U1.23), PowerDevices (U4.7)
NetU1_24: Main (U1.24), PowerDevices (U4.6)
NetU1_26: Main (U1.26), PowerDevices (U6.2)
NetU1_27: Main (U1.27), PowerDevices (U6.7)
NetU1_28: Main (U1.28), PowerDevices (U6.6)
NetU1_30: Main (U1.30), PowerDevices (U7.7)
NetU1_31: Main (U1.31), PowerDevices (U7.8)
NetU1_49: Main (U1.49), Sensors (U5.3)
NetU1_51: Main (U1.51), Sensors (U5.4)
NetU1_52: Main (U1.52), Sensors (U5.5)